# EAGLE schematic powerStageC_rev2 (EAGLE 7.1.0)
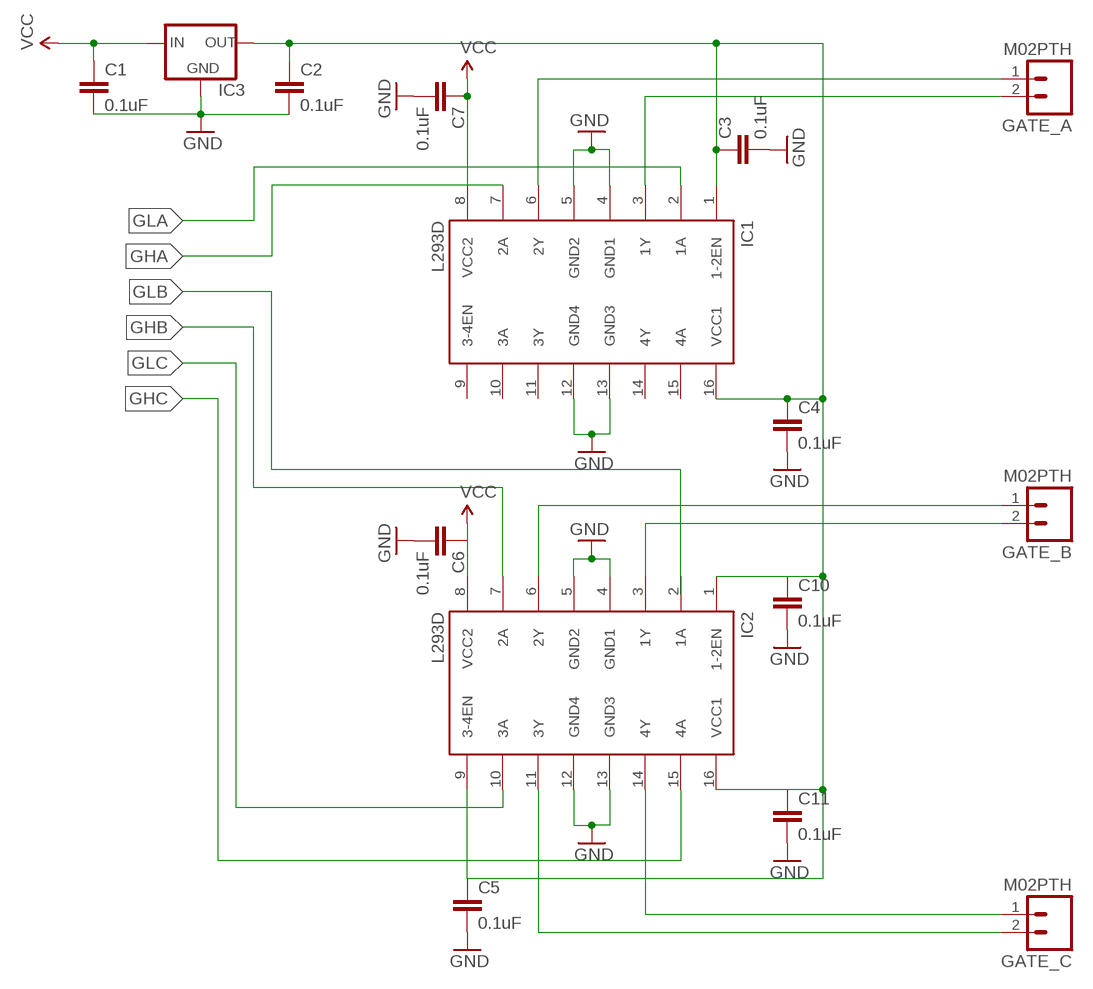
[diagram p0: schematic, sheet 1]

## Parts
C1  0.1uF  0.1UF-25V(+80/-20%)(0603)  [0603-CAP]
C2  0.1uF  0.1UF-25V(+80/-20%)(0603)  [0603-CAP]
C3  0.1uF  0.1UF-25V(+80/-20%)(0603)  [0603-CAP]
C4  0.1uF  0.1UF-25V(+80/-20%)(0603)  [0603-CAP]
C5  0.1uF  0.1UF-25V(+80/-20%)(0603)  [0603-CAP]
C6  0.1uF  0.1UF-25V(+80/-20%)(0603)  [0603-CAP]
C7  0.1uF  0.1UF-25V(+80/-20%)(0603)  [0603-CAP]
C10  0.1uF  0.1UF-25V(+80/-20%)(0603)  [0603-CAP]
C11  0.1uF  0.1UF-25V(+80/-20%)(0603)  [0603-CAP]
GATE_A  M02PTH  [1X02]
GATE_B  M02PTH  [1X02]
GATE_C  M02PTH  [1X02]
IC1  L293D  [DIL16]
IC2  L293D  [DIL16]
IC3  V_REG_78XX-TO-220  [TO-220-ALT]

## Nets
GHA: IC1.7(2A)
GHB: IC2.7(2A)
GHC: IC2.15(4A)
GLA: IC1.2(1A)
GLC: IC2.10(3A)
GND: C1.2 C2.2 C3.2 C4.2 C5.2 C6.2 C7.2 C10.2 C11.2 IC1.4(GND1) IC1.5(GND2) IC2.4(GND1) IC2.5(GND2) IC3.GND
N$1: C2.1 C3.1 C4.1 IC1.1(1-2EN) IC1.16(VCC1) IC2.1(1-2EN) IC2.9(3-4EN) IC2.16(VCC1) IC3.OUT
N$2: GATE_A.2 IC1.3(1Y)
N$3: GATE_A.1 IC1.6(2Y)
N$4: GATE_B.2 IC2.3(1Y)
N$5: GATE_B.1 IC2.6(2Y)
N$6: GATE_C.1 IC2.14(4Y)
N$7: GATE_C.2 IC2.11(3Y)
VCC: C1.1 C7.1 IC2.8(VCC2) IC3.IN
Unconnected: C5.1 C6.1 C10.1 C11.1 IC1.9(3-4EN) IC1.10(3A) IC1.11(3Y) IC1.14(4Y) IC1.15(4A) IC2.2(1A)

## Power pins joined to a net without a drawn wire
GND3: IC1.13(GND3) IC2.13(GND3)
GND4: IC1.12(GND4) IC2.12(GND4)
VCC2: IC1.8(VCC2)

## Library data of the parts
C1-C7 C10 C11 = SparkFun-Capacitors:0.1UF-25V(+80/-20%)(0603): CAP-00810 Ceramic Standard decoupling cap; PROD_ID: CAP-00810
GATE_A GATE_B GATE_C = SparkFun-Connectors:M02: Standard 2-pin 0.1" header. Use with - straight break away headers ( PRT-00116) - right angle break away headers (PRT-00553) - swiss pins (PRT-00743) - machine pins (PRT-00117) - female headers (PRT-00115) Molex polarized connector foot print use with: PRT-08233 with associated crimp pins and housings. 2.54_SCREWTERM for use with PRT-10571. 3.5mm Screw Terminal footprints for PRT-08084 5mm Screw Terminal footprints for use with PRT-08432
IC1 IC2 = st-microelectronics:L293D: PUSH-PULL 4 CHANNEL DRIVER; MPN: L293D; OC_FARNELL: 9589619; OC_NEWARK: 56P8249
IC3 = SparkFun-PowerIC:V_REG_78XX: Voltage Regulator Standard 7805 5V regulator. IGO (Input Ground Output). Spark Fun Electronics SKU : COM-00107